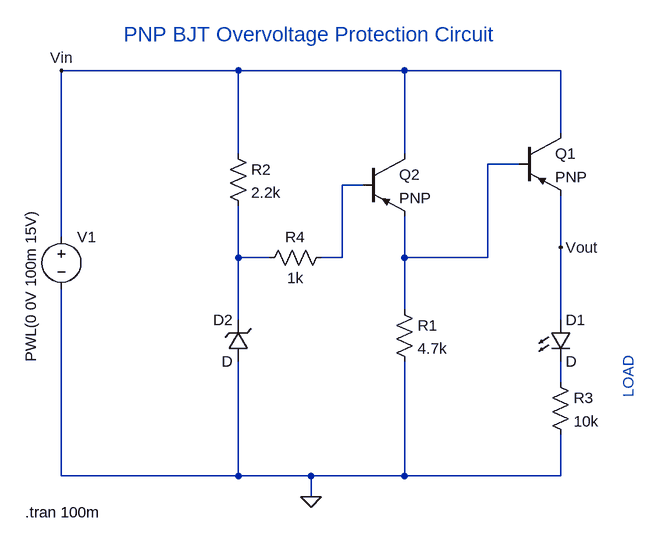
[diagram p0: schematic PNP_BJT_Overvoltage_Protection_Circuit.asc]
PNP_BJT_Overvoltage_Protection_Circuit.asc, the LTspice schematic file:
Version 4
SHEET 1 880 680
WIRE -112 -176 -384 -176
WIRE 144 -176 -112 -176
WIRE 384 -176 144 -176
WIRE 384 -80 384 -176
WIRE -112 -48 -112 -176
WIRE 144 -48 144 -176
WIRE 320 -32 272 -32
WIRE 80 0 48 0
WIRE -384 80 -384 -176
WIRE 384 96 384 16
WIRE -112 112 -112 32
WIRE -64 112 -112 112
WIRE 48 112 48 0
WIRE 48 112 16 112
WIRE 144 112 144 48
WIRE 272 112 272 -32
WIRE 272 112 144 112
WIRE 144 192 144 112
WIRE -112 208 -112 112
WIRE 384 208 384 96
WIRE 384 304 384 272
WIRE -384 448 -384 160
WIRE -112 448 -112 272
WIRE -112 448 -384 448
WIRE 0 448 -112 448
WIRE 144 448 144 272
WIRE 144 448 0 448
WIRE 384 448 384 384
WIRE 384 448 144 448
WIRE 0 480 0 448
FLAG 0 480 0
FLAG 384 96 Vout
FLAG -384 -176 Vin
SYMBOL LED 368 208 R0
SYMATTR InstName D1
SYMBOL res 128 176 R0
SYMATTR InstName R1
SYMATTR Value 4.7k
SYMBOL pnp 320 -80 R0
SYMATTR InstName Q1
SYMBOL pnp 80 -48 R0
SYMATTR InstName Q2
SYMBOL res -128 -64 R0
SYMATTR InstName R2
SYMATTR Value 2.2k
SYMBOL res 368 288 R0
SYMATTR InstName R3
SYMATTR Value 10k
SYMBOL zener -96 272 R180
WINDOW 0 24 64 Left 2
WINDOW 3 24 0 Left 2
SYMATTR InstName D2
SYMBOL voltage -384 64 R0
WINDOW 3 -47 209 VLeft 2
WINDOW 123 0 0 Left 0
WINDOW 39 0 0 Left 0
SYMATTR InstName V1
SYMATTR Value PWL(0 0V 100m 15V)
SYMBOL res 32 96 R90
WINDOW 0 0 56 VBottom 2
WINDOW 3 32 56 VTop 2
SYMATTR InstName R4
SYMATTR Value 1k
TEXT 488 328 VLeft 2 ;LOAD
TEXT -288 -232 Left 3 ;PNP BJT Overvoltage Protection Circuit
TEXT -440 504 Left 2 !.tran 100m

The netlist it stands for:
* PNP_BJT_Overvoltage_Protection_Circuit.asc
D1 Vout N004 D
R1 N001 0 4.7k
Q1 Vin N001 Vout 0 PNP
Q2 Vin N002 N001 0 PNP
R2 Vin N003 2.2k
R3 N004 0 10k
D2 0 N003 D
V1 Vin 0 PWL(0 0V 100m 15V)
R4 N002 N003 1k
.model D D
.lib standard.dio
.model NPN NPN
.model PNP PNP
.lib standard.bjt
* LOAD
* PNP BJT Overvoltage Protection Circuit
.tran 100m
.backanno
.end